# Altium project water-meter.PrjPcb
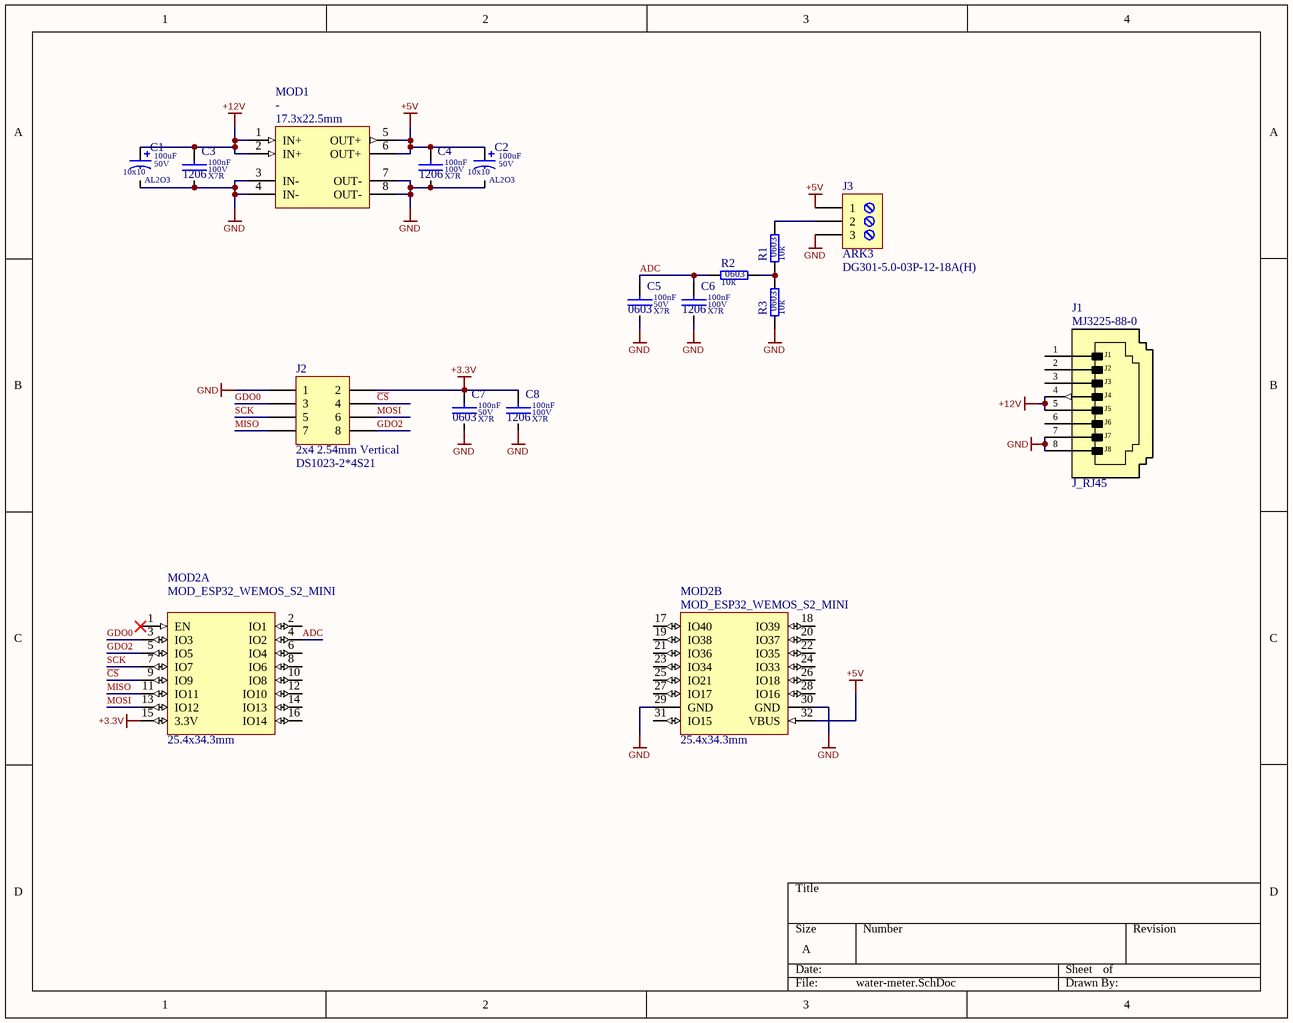
[diagram p0: water-meter.SchDoc]
1 sheet, 16 parts. Net scope: global (net labels, ports and power ports of the same name join across sheets).
Board file: water-meter.PcbDoc

## Sheet water-meter.SchDoc
size A; SheetNumber: 1; SheetTotal: 1

### Parts
C1  value 100uF  Dielectric: AL2O3  SCH_Footprint: 10x10  Voltage: 50V  [CE_D_10x10_SMD]  (hidden comment: Electrolytic Capacitor)
C2  value 100uF  Dielectric: AL2O3  SCH_Footprint: 10x10  Voltage: 50V  [CE_D_10x10_SMD]  (hidden comment: Electrolytic Capacitor)
C3  value 100nF  Dielectric: X7R  Voltage: 100V  SCH_Footprint: 1206  [C_1206_3216]  (hidden comment: Ceramic X7R)
C4  value 100nF  Dielectric: X7R  Voltage: 100V  SCH_Footprint: 1206  [C_1206_3216]  (hidden comment: Ceramic X7R)
C5  value 100nF  Dielectric: X7R  Voltage: 50V  SCH_Footprint: 0603  [C_0603_1608]  (hidden comment: Ceramic X7R)
C6  value 100nF  Dielectric: X7R  Voltage: 100V  SCH_Footprint: 1206  [C_1206_3216]  (hidden comment: Ceramic X7R)
C7  value 100nF  Dielectric: X7R  Voltage: 50V  SCH_Footprint: 0603  [C_0603_1608]  (hidden comment: Ceramic X7R)
C8  value 100nF  Dielectric: X7R  Voltage: 100V  SCH_Footprint: 1206  [C_1206_3216]  (hidden comment: Ceramic X7R)
J1  value MJ3225-88-0  [J_RJ45_MJ3225-88-0]  (hidden comment: Modular Connector, Modular Jack, 1 x 1 (Port), 8P8C, Cat3)
J2  value DS1023-2*4S21  SCH_Footprint: 2x4 2.54mm Vertical  [J_HEADER_2x4_2.54_VERTICAL]  (hidden comment: Goldpin female straight)
J3  value DG301-5.0-03P-12-18A(H)  [J_ARK3]  (hidden comment: ARK3)
MOD1  SCH_Footprint: 17.3x22.5mm  [MOD_BUCK_MP1584]  (hidden comment: Low cost, Aliexpress-ready DC-DC buck converter using MP1584)
MOD2  value MOD_ESP32_WEMOS_S2_MINI  SCH_Footprint: 25.4x34.3mm  [MOD_ESP32_WEMOS_S2_MINI]  (hidden comment: ESP32-S2FN4R2 mini wifi board)  (parts A,B of 2)
R1  value 10k  SCH_Footprint: 0603  [R_0603_1608]  (hidden comment: Resistor)
R2  value 10k  SCH_Footprint: 0603  [R_0603_1608]  (hidden comment: Resistor)
R3  value 10k  SCH_Footprint: 0603  [R_0603_1608]  (hidden comment: Resistor)

### Nets
+3.3V: C7.1 C8.1 J2.2 MOD2.15(3.3V)
+5V: C2.1 C4.1 J3.1 MOD1.5(OUT+) MOD1.6(OUT+) MOD2.32(VBUS)
+12V: C1.1 C3.1 J1.4 J1.5 MOD1.1(IN+) MOD1.2(IN+)
GND: C1.2 C2.2 C3.2 C4.2 C5.2 C6.2 C7.2 C8.2 J1.7 J1.8 J2.1 J3.3 MOD1.3(IN-) MOD1.4(IN-) MOD1.7(OUT-) MOD1.8(OUT-) MOD2.29(GND) MOD2.30(GND) R3.1
~{CS}: J2.4 MOD2.9(IO9)
ADC: C5.1 C6.1 MOD2.4(IO2) R2.1
GDO0: J2.3 MOD2.3(IO3)
GDO2: J2.8 MOD2.5(IO5)
MISO: J2.7 MOD2.11(IO11)
MOSI: J2.6 MOD2.13(IO12)
SCK: J2.5 MOD2.7(IO7)
NetJ3_2: J3.2 R1.2
NetR1_1: R1.1 R2.2 R3.2

Not connected (* = marked no-connect by the designer): J1 1 2 3 6; MOD2 1(EN)* 2(IO1) 6(IO4) 8(IO6) 10(IO8) 12(IO10) 14(IO13) 16(IO14) 17(IO40) 18(IO39) 19(IO38) 20(IO37) 21(IO36) 22(IO35) 23(IO34) 24(IO33) 25(IO21) 26(IO18) 27(IO17) 28(IO16) 31(IO15)

### Notes on the sheet
- (in symbol J_RJ45_MJ3225-88-0) J2; J3; J4; J5; J6; J7; J8

### Library data of the parts
C1 C2 = CE_100uF_50V_AL2O3_10x10_20: Polarized Capacitor; Manufacturer: Nichicon; Manufacturer Part Number: UUX1H101MNL1GS; Tolerance (%): 20; Part Number: CE_100uF_50V_AL2O3_10x10_20; HelpURL: https://datasheet.octopart.com/UUX1H101MNL1GS-Nichicon-datasheet-62047998.pdf; Supplier 1: TME; Supplier Part Number 1: UUX1H101MNL1GS; Supplier 2: RS Components; Supplier Part Number 2: 7393107; Supplier 3: Farnell; Supplier Part Number 3: 2841943; Supplier 4: Mouser; Supplier Part Number 4: 647-UUX1H101MNL1GS; Supplier 5: Digi-Key; Supplier Part Number 5: 493-6269-1-ND; Supplier 6: LCSC
C3 C4 C6 C8 = C_100nF_100V_X7R_1206_10: Capacitor; Manufacturer: Samsung; Manufacturer Part Number: CL31B104KCFNNNE; Tolerance (%): 10; Part Number: C_100nF_100V_X7R_1206_10; HelpURL: https://datasheet.octopart.com/CL31B104KCFNNNE-Samsung-datasheet-8331463.pdf; Supplier 1: TME; Supplier 2: RS Components; Supplier 3: Farnell; Supplier 4: Mouser; Supplier 5: Digi-Key; Supplier 6: LCSC
C5 C7 = C_100nF_50V_X7R_0603_10_AECQ1: Capacitor; Manufacturer: Murata; Manufacturer Part Number: GCM188R71H104KA57D; Tolerance (%): 10; AEC-Q: 1; Part Number: C_100nF_50V_X7R_0603_10_AECQ1; HelpURL: https://www.murata.com/products/productdetail?partno=GCM188R71H104KA57%23; Supplier 1: TME; Supplier Part Number 1: GCM188R71H104KA57D; Supplier 2: RS Components; Supplier 3: Farnell; Supplier Part Number 3: 4360223; Supplier 4: Mouser; Supplier Part Number 4: 81-GCM188R71H104KA7D; Supplier 5: Digi-Key; Supplier Part Number 5: 490-4779-1-ND; Supplier 6: LCSC; Supplier Part Number 6: C85864
J1 = J_RJ45_MJ3225-88-0: Manufacturer: Global Connector Technology; SCH_Footprint: J_RJ45; Part Number: J_RJ45_MJ3225-88-0; HelpURL: https://www.farnell.com/cad/3781788.pdf; Manufacturer Part Number: MJ3225-88-0; Supplier 1: TME; Supplier 2: RS Components; Supplier 3: Farnell; Supplier Part Number 3: 4071641; Supplier 4: Mouser; Supplier 5: Digi-Key; Supplier 6: LCSC; Supplier 7: Newark; Supplier Part Number 7: 61AK4308
J2 = J_HEADER_2x4_2.54_VERTICAL: Pin Header; Manufacturer: Connfly; Part Number: J_HEADER_2x4_2.54_VERTICAL; HelpURL: https://datasheet.octopart.com/DS1023-2%2A14S21-Connfly-datasheet-81850794.pdf; Manufacturer Part Number: DS1023-2*4S21; Supplier 1: TME; Supplier Part Number 1: ZL262-8DG; Supplier 2: RS Components; Supplier 3: Farnell; Supplier 4: Mouser; Supplier 5: Digi-Key; Supplier 6: LCSC
J3 = J_TB-5.0-P-3P: ARK Screw terminal, 3-Pin; Manufacturer: DEGSON ELECTRONICS; SCH_Footprint: ARK3; Part Number: J_TB-5.0-P-3P; HelpURL: https://datasheet.octopart.com/DG301-5.0-03P-12-18A%28H%29-Degson-datasheet-17801202.pdf; Manufacturer Part Number: DG301-5.0-03P-12-18A(H); Supplier 1: TME; Supplier Part Number 1: DG301-5.0-3/6B; Supplier 2: RS Components; Supplier 3: Farnell; Supplier 4: Mouser; Supplier 5: Digi-Key; Supplier 6: LCSC
MOD1 = MOD_BUCK_MP1584: Value: -; Part Number: MOD_BUCK_MP1584; HelpURL: https://pl.aliexpress.com/item/32341006065.html; Manufacturer: -; Manufacturer Part Number: -; Supplier 1: TME; Supplier 2: RS Components; Supplier 3: Farnell; Supplier 4: Mouser; Supplier 5: Digi-Key; Supplier 6: LCSC; Supplier 7: -; Supplier Part Number 7: -
MOD2 = MOD_ESP32_WEMOS_S2_MINI: Manufacturer: Wemos; Part Number: MOD_ESP32_WEMOS_S2_MINI; HelpURL: https://www.wemos.cc/en/latest/s2/s2_mini.html; Manufacturer Part Number: MOD_ESP32_WEMOS_S2_MINI; Supplier 1: TME; Supplier 2: RS Components; Supplier 3: Farnell; Supplier 4: Mouser; Supplier 5: Digi-Key; Supplier 6: LCSC; Supplier 7: Aliexpress; Supplier Part Number 7: https://pl.aliexpress.com/item/1005003145192016.html
R1-R3 = R_10k_0603_1_AECQ0: Manufacturer: Panasonic; Manufacturer Part Number: ERJ-3EKF1002V; Voltage: 75V; Power: 100mW; Tolerance: 1%; AEC-Q: 0; Part Number: R_10k_0603_1_AECQ0; HelpURL: https://industrial.panasonic.com/cdbs/www-data/pdf/RDA0000/AOA0000C304.pdf; Supplier 1: TME; Supplier Part Number 1: ERJ3EKF1002V; Supplier 2: RS Components; Supplier 3: Farnell; Supplier Part Number 3: 2303192; Supplier 4: Mouser; Supplier Part Number 4: 667-ERJ-3EKF1002V; Supplier 5: Digi-Key; Supplier Part Number 5: P10.0KHCT-ND; Supplier 6: LCSC; Supplier Part Number 6: C191124